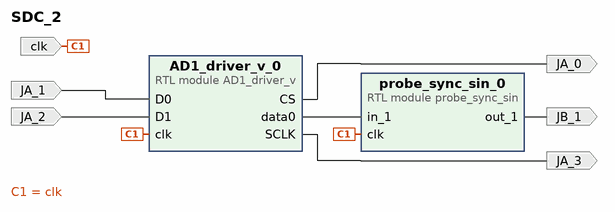
[diagram p0: block diagram of the top level]
# Vivado block design SDC_2, Vivado 2016.1
create_bd_design SDC_2

create_bd_port -dir I clk
create_bd_port -dir I JA_1
create_bd_port -dir I JA_2
create_bd_port -dir O JA_0
create_bd_port -dir O JA_3
create_bd_port -dir O JB_1

create_bd_cell -type module -reference probe_sync_sin probe_sync_sin_0
create_bd_cell -type module -reference AD1_driver_v AD1_driver_v_0

# ---- connections ----

connect_bd_net [get_bd_ports clk] [get_bd_pins probe_sync_sin_0/clk] [get_bd_pins AD1_driver_v_0/clk]
connect_bd_net -net D0_1 [get_bd_ports JA_1] [get_bd_pins AD1_driver_v_0/D0]
connect_bd_net -net D1_1 [get_bd_ports JA_2] [get_bd_pins AD1_driver_v_0/D1]
connect_bd_net [get_bd_pins AD1_driver_v_0/data0] [get_bd_pins probe_sync_sin_0/in_1]
connect_bd_net [get_bd_pins AD1_driver_v_0/CS] [get_bd_ports JA_0]
connect_bd_net [get_bd_pins AD1_driver_v_0/SCLK] [get_bd_ports JA_3]
connect_bd_net [get_bd_pins probe_sync_sin_0/out_1] [get_bd_ports JB_1]

validate_bd_design
save_bd_design
